# Altium schematic sheet SPI_IFC.SchDoc: Title
size 420 x 297 mm; Author: G.Kasprowicz; CompanyName: WUT ISE; DrawnBy: G.Kasprowicz; Organization: WUT ISE; Address1: PW ISE; Address2: Nowowiejska 15/19 00-665 Warsaw; Address3: gkasprow@gmail.com; Revision: 1.0; SheetNumber: 2; SheetTotal: 2; ModifiedBy: -; CheckedDate: -; Title2: Title2; DivGrp: WUT ISE; Designer: G.Kasprowicz; SPICEModelCacheRYPVXPCY: <root> / <DocumentId>RYPVXPCY</DocumentId> / </root>; ModifiedDate: -; ProjectName: Sensor Box
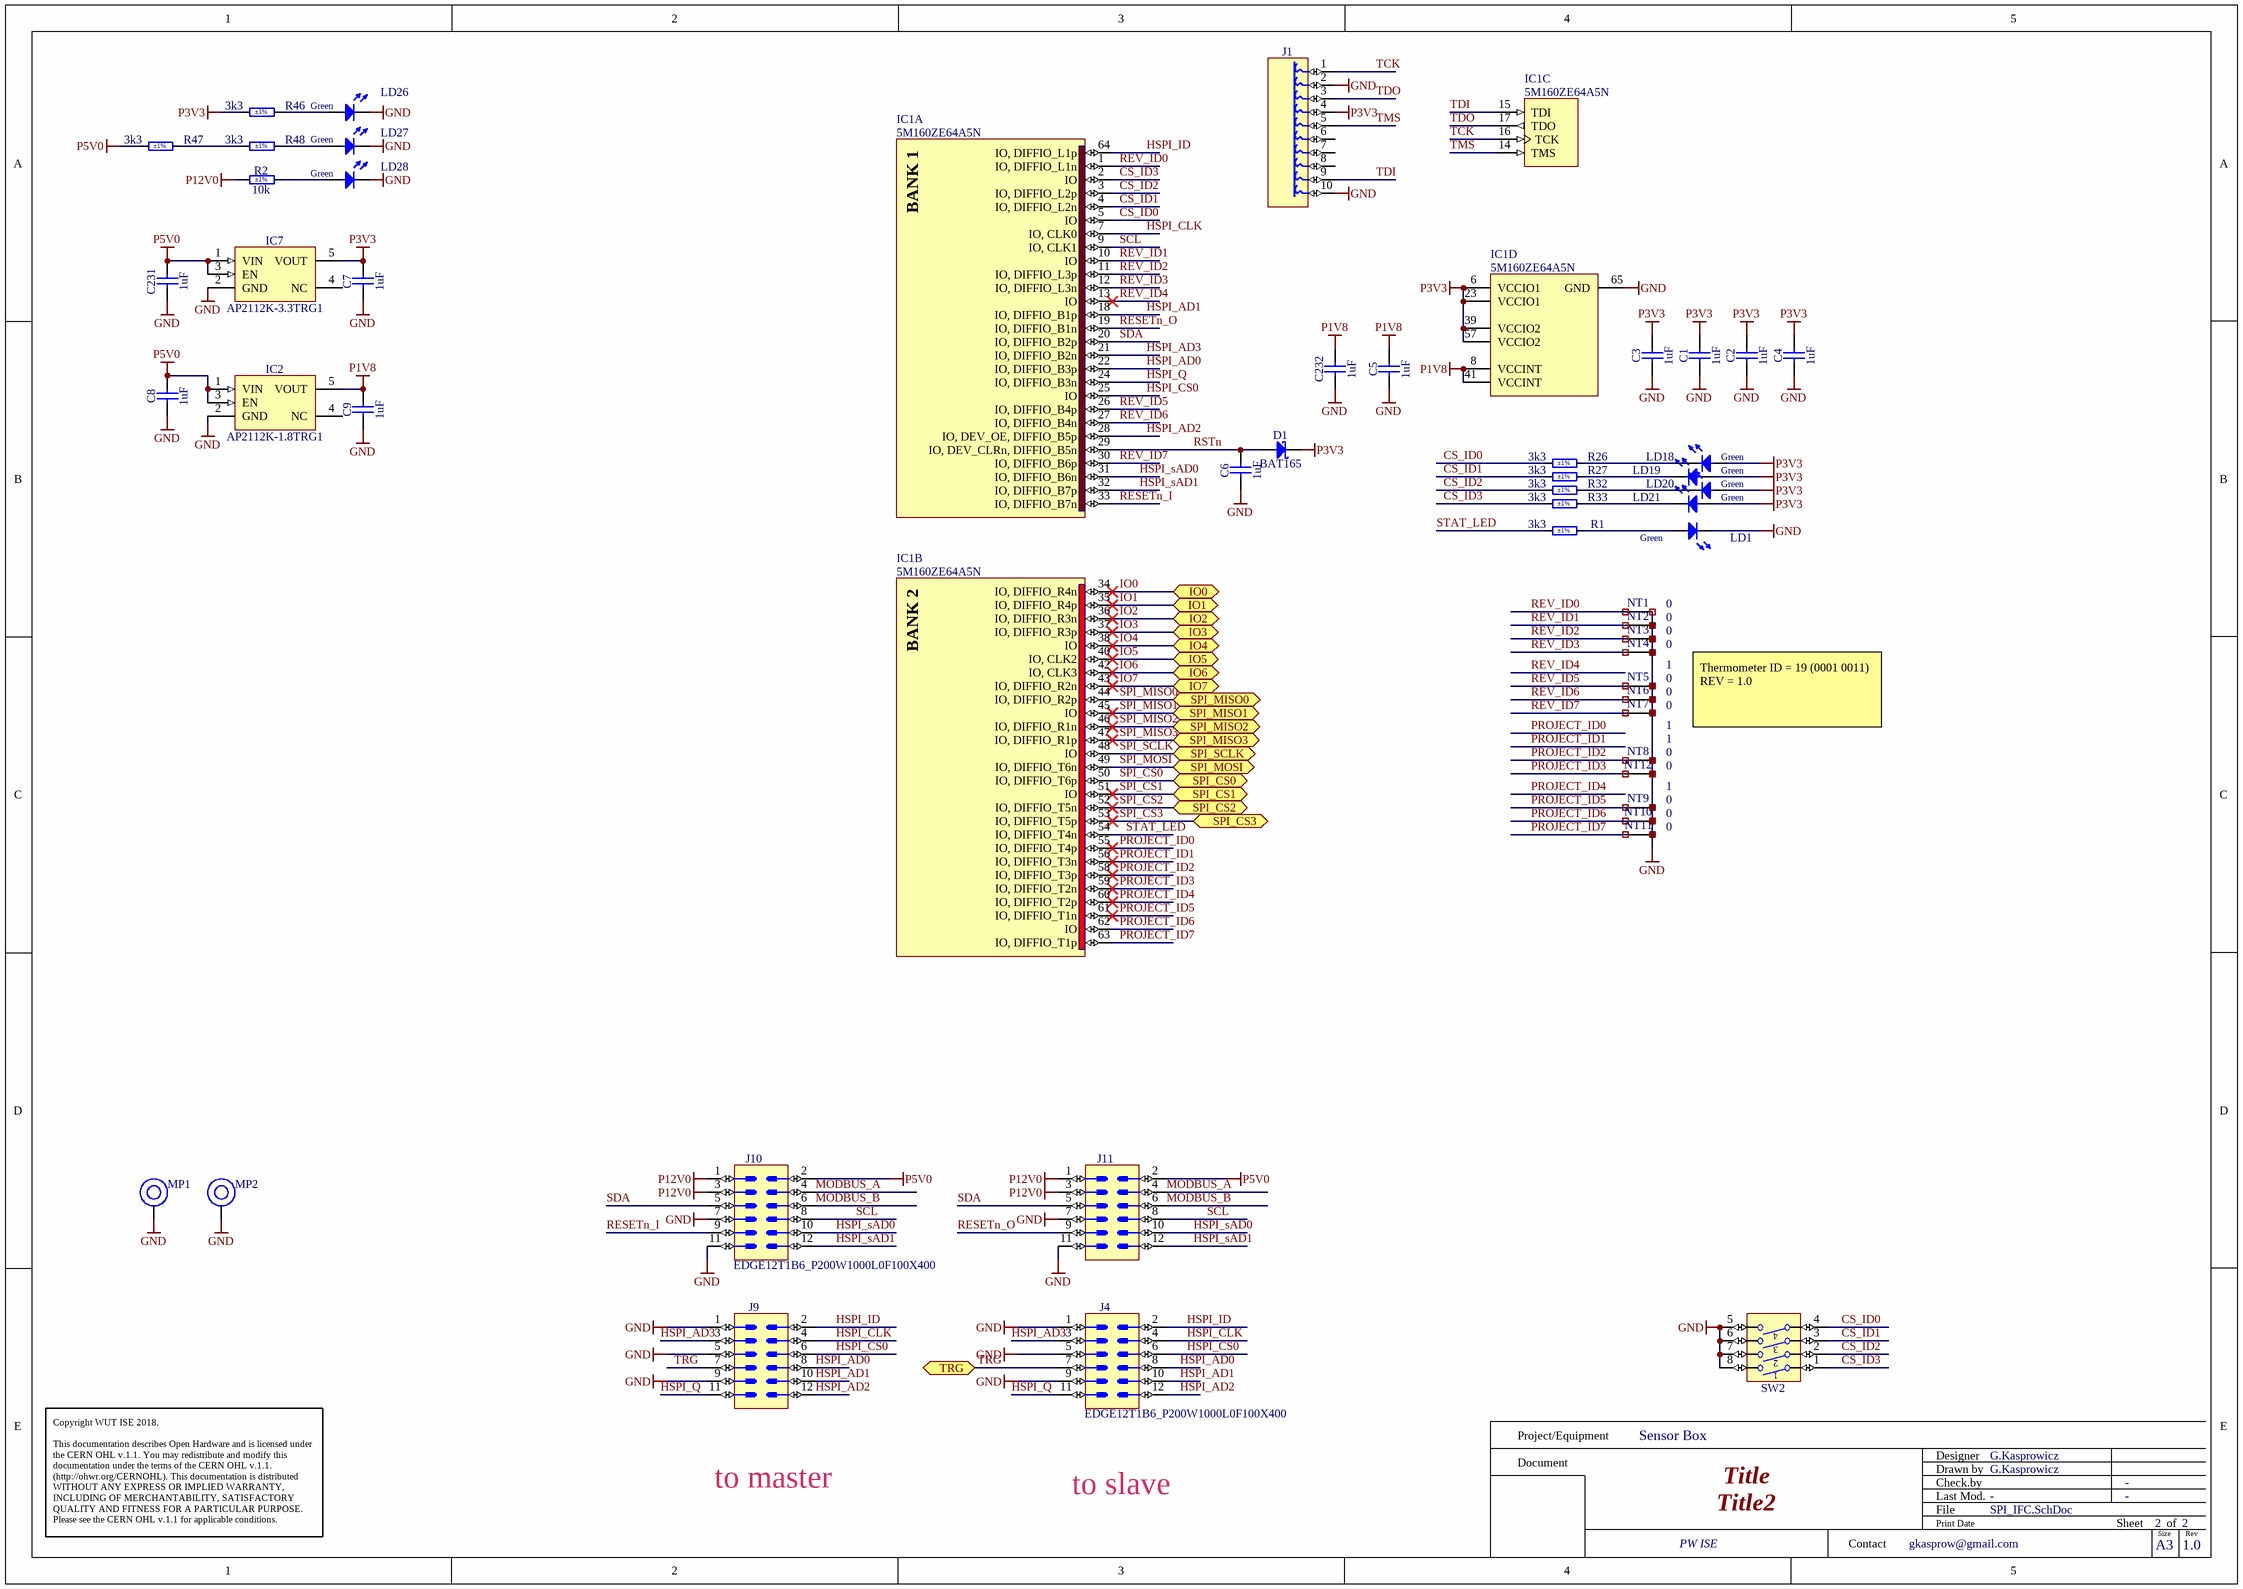
[diagram p0: SPI_IFC.SchDoc]

## Parts
C1  1uF  [CAPC1005X55N]
C2  1uF  [CAPC1005X55N]
C3  1uF  [CAPC1005X55N]
C4  1uF  [CAPC1005X55N]
C5  1uF  [CAPC1005X55N]
C6  1uF  [CAPC1005X55N]
C7  1uF  [CAPC1005X55N]
C8  1uF  [CAPC1005X55N]
C9  1uF  [CAPC1005X55N]
C231  1uF  [CAPC1005X55N]
C232  1uF  [CAPC1005X55N]
D1  BAT165  [SOD2512X110N]
IC1  5M160ZE64A5N  [QFP40P900X900X120-65N-S550]  (parts A,B,C,D of 4)
IC2  AP2112K-1.8TRG1  [SOT95P285X140-5N]
IC7  AP2112K-3.3TRG1  [SOT95P285X140-5N]
J1  TC2050-IDC  [TC2050-IDC]  (value not drawn)
J4  (no value)  [EDGE12T1B6_P200W1000L0F100X400]
J9  (no value)  [EDGE12T5B10_P200W1000L0F100X400]
J10  (no value)  [EDGE12T1B6_P200W1000L0F100X400]
J11  (no value)  [EDGE12T5B10_P200W1000L0F100X400]
LD1  Green  [LED_KINGBRIGHT_KP-1608CGCK]
LD18  Green  [LED_KINGBRIGHT_KP-1608CGCK]
LD19  Green  [LED_KINGBRIGHT_KP-1608CGCK]
LD20  Green  [LED_KINGBRIGHT_KP-1608CGCK]
LD21  Green  [LED_KINGBRIGHT_KP-1608CGCK]
LD26  Green  [LED_KINGBRIGHT_KP-1608CGCK]
LD27  Green  [LED_KINGBRIGHT_KP-1608CGCK]
LD28  Green  [LED_KINGBRIGHT_KP-1608CGCK]
MP1  M1.6 x 3mm  [97730306330]  (value not drawn)
MP2  M1.6 x 3mm  [97730306330]  (value not drawn)
NT1  Net Tie  [Net Tie 3]  (value not drawn)  (net tie, no BOM)
NT2  Net Tie  [Net Tie 3]  (value not drawn)  (net tie, no BOM)
NT3  Net Tie  [Net Tie 3]  (value not drawn)  (net tie, no BOM)
NT4  Net Tie  [Net Tie 3]  (value not drawn)  (net tie, no BOM)
NT5  Net Tie  [Net Tie 3]  (value not drawn)  (net tie, no BOM)
NT6  Net Tie  [Net Tie 3]  (value not drawn)  (net tie, no BOM)
NT7  Net Tie  [Net Tie 3]  (value not drawn)  (net tie, no BOM)
NT8  Net Tie  [Net Tie 3]  (value not drawn)  (net tie, no BOM)
NT9  Net Tie  [Net Tie 3]  (value not drawn)  (net tie, no BOM)
NT10  Net Tie  [Net Tie 3]  (value not drawn)  (net tie, no BOM)
NT11  Net Tie  [Net Tie 3]  (value not drawn)  (net tie, no BOM)
NT12  Net Tie  [Net Tie 3]  (value not drawn)  (net tie, no BOM)
R1  3k3  Tolerance: ±1%  [RESC1005X40N]
R2  10k  Tolerance: ±1%  [RESC1005X40N]
R26  3k3  Tolerance: ±1%  [RESC1005X40N]
R27  3k3  Tolerance: ±1%  [RESC1005X40N]
R32  3k3  Tolerance: ±1%  [RESC1005X40N]
R33  3k3  Tolerance: ±1%  [RESC1005X40N]
R46  3k3  Tolerance: ±1%  [RESC1005X40N]
R47  3k3  Tolerance: ±1%  [RESC1005X40N]
R48  3k3  Tolerance: ±1%  [RESC1005X40N]
SW2  Switch  [SW_OMRON_A6H-4102]  (value not drawn)

## Ports
IO0 (bidir), IO1 (bidir), IO2 (bidir), IO3 (bidir), IO4 (bidir), IO5 (bidir), IO6 (bidir), IO7 (bidir), SPI_CS0 (bidir), SPI_CS1 (bidir), SPI_CS2 (bidir), SPI_CS3 (bidir), SPI_MISO0 (bidir), SPI_MISO1 (bidir), SPI_MISO2 (bidir), SPI_MISO3 (bidir), SPI_MOSI (bidir), SPI_SCLK (bidir), TRG (bidir)

## Nets
GND: C1.1 C2.1 C3.1 C4.1 C5.1 C6.1 C7.1 C8.1 C9.1 C231.1 C232.1 IC1.65(GND) IC2.2(GND) IC7.2(GND) J1.2 J1.10 J4.1 J4.5 J4.9 J9.1 J9.5 J9.9 J10.7 J10.11 J11.7 J11.11 LD1.1(C) LD26.1(C) LD27.1(C) LD28.1(C) MP1.1 MP2.1 NT1.2 NT2.2 NT3.2 NT4.2 NT5.2 NT6.2 NT7.2 NT8.2 NT9.2 NT10.2 NT11.2 NT12.2 SW2.5 SW2.6 SW2.7 SW2.8
P1V8: C5.2 C9.2 C232.2 IC1.8(VCCINT) IC1.41(VCCINT) IC2.5(VOUT)
P3V3: C1.2 C2.2 C3.2 C4.2 C7.2 D1.1(C) IC1.6(VCCIO1) IC1.23(VCCIO1) IC1.39(VCCIO2) IC1.57(VCCIO2) IC7.5(VOUT) J1.4 LD18.2(A) LD19.2(A) LD20.2(A) LD21.2(A) R46.2
P5V0: C8.2 C231.2 IC2.1(VIN) IC2.3(EN) IC7.1(VIN) IC7.3(EN) J10.2 J11.2 R47.2
P12V0: J10.1 J10.3 J11.1 J11.3 R2.1
CS_ID0: IC1.5(IO) R26.2 SW2.4
CS_ID1: IC1.4(IO,_DIFFIO_L2n) R27.2 SW2.3
CS_ID2: IC1.3(IO,_DIFFIO_L2p) R32.2 SW2.2
CS_ID3: IC1.2(IO) R33.2 SW2.1
HSPI_AD0: IC1.22(IO,_DIFFIO_B3p) J4.8 J9.8
HSPI_AD1: IC1.18(IO,_DIFFIO_B1p) J4.10 J9.10
HSPI_AD2: IC1.28(IO,_DEV_OE,_DIFFIO_B5p) J4.12 J9.12
HSPI_AD3: IC1.21(IO,_DIFFIO_B2n) J4.3 J9.3
HSPI_CLK: IC1.7(IO,_CLK0) J4.4 J9.4
HSPI_CS0: IC1.25(IO) J4.6 J9.6
HSPI_ID: IC1.64(IO,_DIFFIO_L1p) J4.2 J9.2
HSPI_Q: IC1.24(IO,_DIFFIO_B3n) J4.11 J9.11
HSPI_sAD0: IC1.31(IO,_DIFFIO_B6n) J10.10 J11.10
HSPI_sAD1: IC1.32(IO,_DIFFIO_B7p) J10.12 J11.12
IO0: IC1.34(IO,_DIFFIO_R4n) ; port IO0
IO1: IC1.35(IO,_DIFFIO_R4p) ; port IO1
IO2: IC1.36(IO,_DIFFIO_R3n) ; port IO2
IO3: IC1.37(IO,_DIFFIO_R3p) ; port IO3
IO4: IC1.38(IO) ; port IO4
IO5: IC1.40(IO,_CLK2) ; port IO5
IO6: IC1.42(IO,_CLK3) ; port IO6
IO7: IC1.43(IO,_DIFFIO_R2n) ; port IO7
MODBUS_A: J10.4 J11.4
MODBUS_B: J10.6 J11.6
PROJECT_ID0: IC1.55(IO,_DIFFIO_T4p)
PROJECT_ID1: IC1.56(IO,_DIFFIO_T3n)
PROJECT_ID2: IC1.58(IO,_DIFFIO_T3p) NT8.1
PROJECT_ID3: IC1.59(IO,_DIFFIO_T2n) NT12.1
PROJECT_ID4: IC1.60(IO,_DIFFIO_T2p)
PROJECT_ID5: IC1.61(IO,_DIFFIO_T1n) NT9.1
PROJECT_ID6: IC1.62(IO) NT10.1
PROJECT_ID7: IC1.63(IO,_DIFFIO_T1p) NT11.1
RESETn_I: IC1.33(IO,_DIFFIO_B7n) J10.9
RESETn_O: IC1.19(IO,_DIFFIO_B1n) J11.9
REV_ID0: IC1.1(IO,_DIFFIO_L1n) NT1.1
REV_ID1: IC1.10(IO) NT2.1
REV_ID2: IC1.11(IO,_DIFFIO_L3p) NT3.1
REV_ID3: IC1.12(IO,_DIFFIO_L3n) NT4.1
REV_ID4: IC1.13(IO)
REV_ID5: IC1.26(IO,_DIFFIO_B4p) NT5.1
REV_ID6: IC1.27(IO,_DIFFIO_B4n) NT6.1
REV_ID7: IC1.30(IO,_DIFFIO_B6p) NT7.1
RSTn: C6.2 D1.2(A) IC1.29(IO,_DEV_CLRn,_DIFFIO_B5n)
SCL: IC1.9(IO,_CLK1) J10.8 J11.8
SDA: IC1.20(IO,_DIFFIO_B2p) J10.5 J11.5
SPI_CS0: IC1.50(IO,_DIFFIO_T6p) ; port SPI_CS0
SPI_CS1: IC1.51(IO) ; port SPI_CS1
SPI_CS2: IC1.52(IO,_DIFFIO_T5n) ; port SPI_CS2
SPI_CS3: IC1.53(IO,_DIFFIO_T5p) ; port SPI_CS3
SPI_MISO0: IC1.44(IO,_DIFFIO_R2p) ; port SPI_MISO0
SPI_MISO1: IC1.45(IO) ; port SPI_MISO1
SPI_MISO2: IC1.46(IO,_DIFFIO_R1n) ; port SPI_MISO2
SPI_MISO3: IC1.47(IO,_DIFFIO_R1p) ; port SPI_MISO3
SPI_MOSI: IC1.49(IO,_DIFFIO_T6n) ; port SPI_MOSI
SPI_SCLK: IC1.48(IO) ; port SPI_SCLK
STAT_LED: IC1.54(IO,_DIFFIO_T4n) R1.2
TCK: IC1.16(TCK) J1.1
TDI: IC1.15(TDI) J1.9
TDO: IC1.17(TDO) J1.3
TMS: IC1.14(TMS) J1.5
TRG: J4.7 J9.7 ; port TRG
NetLD1_2: LD1.2(A) R1.1
NetLD18_1: LD18.1(C) R26.1
NetLD19_1: LD19.1(C) R27.1
NetLD20_1: LD20.1(C) R32.1
NetLD21_1: LD21.1(C) R33.1
NetLD26_2: LD26.2(A) R46.1
NetLD27_2: LD27.2(A) R48.1
NetLD28_2: LD28.2(A) R2.2
NetR47_1: R47.1 R48.2

Not connected (* = marked no-connect by the designer): IC2 4(NC); IC7 4(NC); J1 6 7 8

## Notes on the sheet
- 0
- 1
- Thermometer ID = 19 (0001 0011)
  REV = 1.0
- to master
- to slave
- Project/Equipment
- Document
- Designer
- Drawn by
- Check.by
- Copyright WUT ISE 2018.
  This documentation describes Open Hardware and is licensed under the CERN OHL v.1.1. You may redistribute and modify this documentation under the terms of the CERN OHL v.1.1. (http://ohwr.org/CERNOHL). This documentation is distributed WITHOUT ANY EXPRESS OR IMPLIED WARRANTY, INCLUDING OF MERCHANTABILITY, SATISFACTORY QUALITY AND FITNESS FOR A PARTICULAR PURPOSE. Please see the CERN OHL v.1.1 for applicable conditions.
- Contact
- File
- Last Mod.
- Print Date
- Sheet
- Size
- A3
- of
- Rev
- (in symbol 5M160ZE64A5N, part A) BANK 1
- (in symbol 5M160ZE64A5N, part B) BANK 2

## Library data of the parts
C1-C9 C231 C232 = CC0402_1UF_16V_10%_X5R: Non-polarised capacitor; Part Description: SMD Multilayer Chip Ceramic Capacitor; Manufacturer: GENERIC; Manufacturer1 Part Number: C1005X5R1C105KT; Voltage: 16V; TC: X5R; Tolerance: ±10%; Part Number: CC0402_1UF_16V_10%_X5R; Component Kind: Standard; Component Type: Standard; Pin Count: 2; Value: 1uF; Status: Preferred; Manufacturer Part Number: CC0402_1UF_16V_10%_X5R; Case: 0402; Mounted: Yes; Socket: No; SMD: Yes; Sense: No; Manufacturer1 Example: TDK; Manufacturer1 ComponentHeight: 0.55mm; HelpURL: \\cern.ch\dfs\Applications\Altium\Datasheets\CC0402_X5R_TDK_C.pdf; Author: CERN DEM JLC; CreateDate: 25.10.2012; LatestRevisionDate: 25.10.2012
D1 = BAT165: Schottky Diode; Part Description: Medium Power AF Schottky Diode; Manufacturer: INFINEON; Voltage: 40V; Power: 750mA; PressFit: No; Bonding: No; Part Number: BAT165; Component Kind: Standard; Component Type: Standard; Device: BAT165; PackageDescription: Small Outline Diode (SOD-323), 1.70mm W X 1.25mm L X 1.10mm H body,  IPC Medium Density; Manufacturer Part Number: BAT165; Pin Count: 2; Case: SOD-323; Mounted: Yes; Socket: No; SMD: Yes; Sense: No; ComponentHeight: 1.1mm; HelpURL: \\cern.ch\dfs\Applications\Altium\Datasheets\BAT165.pdf; Author: CERN DEM JLC; CreateDate: 12.11.2014; LatestRevisionDate: 12.11.2014
IC1 = 5M160ZE64A5N: MAX V 1.8V CPLD, 54 IOs, 160 Logic Elements, 64-Pin EQFP, Automotive Temperature, Speed Grade 5, Pb-Free; Manufacturer: ALTERA; PressFit: No; Bonding: No; Part Number: 5M160ZE64A5N; Component Kind: Standard; Component Type: Standard; Device: 5M160ZE64A5N; PackageDescription: QFP, 0.40mm Pitch, Square; 64 pin, 7.00mm L X 7.00mm W X 1.20mm H body (w/Thermal Tab 5.50 X 5.50mm), IPC Medium Density; Status: Not Recommended; Part Description: MAX V 1.8V CPLD, 54 IOs, 160 Logic Elements, 64-Pin EQFP, Automotive Temperature, Speed Grade 5, Pb-Free; Manufacturer Part Number: 5M160ZE64A5N; Pin Count: 65; Case: QFP64; Mounted: Yes; Socket: No; SMD: Yes; Sense: No; ComponentHeight: 1.2mm; HelpURL: \\cern.ch\dfs\Applications\Altium\Datasheets\5M160ZE64A5N.pdf; ComponentLink1URL: \\cern.ch\dfs\Applications\Altium\Datasheets\5M160ZE64A5N_Package.pdf; ComponentLink1Description: Package Drawing; ComponentLink2URL: \\cern.ch\dfs\Applications\Altium\Datasheets\5M160ZE64A5N_Pinout.pdf; ComponentLink2Description: Pinout; Author: CERN DEM JLC; CreateDate: 07.01.2015; LatestRevisionDate: 27.10.2022
IC2 = AP2112K-1.8TRG1: 600mA CMOS Low Dropout Linear Regulator with Enable; Part Description: 1.8V 600mA CMOS Low Dropout Linear Regulator with Enable; Manufacturer: DIODES INCORPORATED; PressFit: No; Bonding: No; Part Number: AP2112K-1.8TRG1; Component Kind: Standard; Component Type: Standard; Device: AP2112K-1.8TRG1; PackageDescription: SOT23, 0.95mm Pitch; 5 Pin, 1.6mm W X 3.0mm L X 1.40mm H body, IPC Medium Density; Manufacturer Part Number: AP2112K-1.8; Pin Count: 5; Case: SOT25; Mounted: Yes; Socket: No; SMD: Yes; Sense: No; ComponentHeight: 1.4mm; HelpURL: \\cern.ch\dfs\Applications\Altium\Datasheets\AP2112K-1.8TRG1.pdf; Author: CERN DEM JLC; CreateDate: 13.06.2018; LatestRevisionDate: 27.06.2022
IC7 = AP2112K-3.3TRG1: 600mA CMOS Low Dropout Linear Regulator with Enable; Part Description: 3.3V 600mA CMOS Low Dropout Linear Regulator with Enable; Manufacturer: DIODES INCORPORATED; PressFit: No; Bonding: No; Part Number: AP2112K-3.3TRG1; Component Kind: Standard; Component Type: Standard; Device: AP2112K-3.3TRG1; PackageDescription: SOT23, 0.95mm Pitch; 5 Pin, 1.6mm W X 3.0mm L X 1.40mm H body, IPC Medium Density; Manufacturer Part Number: AP2112K-3.3; Pin Count: 5; Case: SOT25; Mounted: Yes; Socket: No; SMD: Yes; Sense: No; ComponentHeight: 1.4mm; HelpURL: \\cern.ch\dfs\Applications\Altium\Datasheets\AP2112K-3.3TRG1.pdf; Author: CERN DEM MR; CreateDate: 13.12.2017; LatestRevisionDate: 27.06.2022
J1 = TC2050-IDC: TC2030-MCP and TC2050-IDC Pad Contact; Part Description: 10 X 31mil Diameter SMD Pad For TC2050-IDC Legged Connector; Mounted: No; Part Number: TC2050-IDC; Component Kind: Standard (No BOM); Component Type: Standard (No BOM); Pin Count: 10; Family: TC2050-IDC; Socket: No; SMD: Yes; Sense: No; Status: None; ComponentHeight: 0mm; HelpURL: \\cern.ch\dfs\Applications\Altium\Datasheets\TC2050-IDC.pdf; Author: CERN DEM HF; CreateDate: 02.05.2024; LatestRevisionDate: 02.05.2024; PackageDescription: 10 X 31mil Diameter SMD Pad For TC2030-MCP Legged Connector
J4 J10 = PCB Edge Connector 12 (2x6): Part Number: EDGE10T1B6_P200W1000L0F100X400; Part Description: 10 Contacts Board Edge Connector, Pitch 2mm, Length 0mm, Width 10mm, Finger Lenght 4mm, Finger Width 1mm; Mounted: No; PressFit: No; Component Kind: Standard (No BOM); Component Type: Standard (No BOM); Pin Count: 12; Socket: No; SMD: No; Sense: No; Status: None; ComponentHeight: 0mm; HelpURL: \\cern.ch\dfs\Applications\Altium\Datasheets\EDGE10T1B6_P200W1000L0F100X400.pdf; Author: CERN DEM MR; CreateDate: 14.02.2018; LatestRevisionDate: 14.02.2018
J9 J11 = PCB Edge Connector 12 (2x6) R: PCB Edge Connector 12 (2x6); Part Description: 12 Contacts Board Edge Connector, Pitch 2mm, Length 0mm, Width 10mm, Finger Lenght 4mm, Finger Width 1mm; Mounted: No; PressFit: No; Part Number: EDGE12T5B10_P200W1000L0F100X400; Component Kind: Standard (No BOM); Component Type: Standard (No BOM); Pin Count: 12; Socket: No; SMD: No; Sense: No; Status: None; ComponentHeight: 0mm; HelpURL: \\cern.ch\dfs\Applications\Altium\Datasheets\EDGE10T5B10_P200W1000L0F100X400.pdf; Author: GK; CreateDate: 14.02.2018; LatestRevisionDate: 14.02.2018
LD1 LD18-LD21 LD26-LD28 = LED_KINGBRIGHT_KP-1608CGCK: LED Green 1C 2A; Part Description: 1.6x0.8mm SMD Chip Green LED Lamp; PressFit: No; Bonding: No; Part Number: LED_KINGBRIGHT_KP-1608CGCK; Component Kind: Standard; Component Type: Standard; Color: Green; PackageDescription: SMT Green LED, Case 0603, Body L 1.60mm x W 0.80mm x H 1.10mm; Manufacturer: KINGBRIGHT; Manufacturer Part Number: KP-1608CGCK; Pin Count: 2; Case: 0603; Mounted: Yes; Socket: No; SMD: Yes; Sense: No; ComponentHeight: 1.1mm; HelpURL: \\cern.ch\dfs\Applications\Altium\Datasheets\LED_KINGBRIGHT_KP-1608CGCK.pdf; Author: CERN DEM HF; CreateDate: 01.10.2021; LatestRevisionDate: 01.10.2021
MP1 MP2 = 97730306330R: WA-SMSI SMT Steel Spacer with internal Thread Bottom closed, OD 3.3mm, M1.6 x 3mm; Manufacturer: Wurth Elektronik; Inside Thread Length: 1.8mm; Surface: Tin; ComponentLink1Description: Website Link; ComponentLink1URL: https://www.we-online.com/redexpert/article/97730306330R?ad; ComponentLink2Description: Datasheet Link; ComponentLink2URL: https://www.we-online.com/redexpert/spec/97730306330R?ad; Manufacturer Part Number: 97730306330R; Category: SMT Spacers; Match Code: WA-SMSI; Mount: Surface Mount; Operating Temperature Max: 150°C; Operating Temperature Min: -55°C; Packaging: Tape and Reel; Height: 3mm; Material: Steel; Outside Diameter: 3.3mm; Thread Size: M1.6
NT1-NT12 = Net Tie 3: Part Description: Net Tie (2 Nets); Mounted: No; Part Number: Net Tie 3; Component Type: Net Tie; Pin Count: 2; Family: Net Tie; Socket: No; SMD: No; Sense: No; Status: None; ComponentHeight: 0mm; HelpURL: Undefined; Author: CERN DEM HF; CreateDate: 23.09.2024; LatestRevisionDate: 23.09.2024; PackageDescription: SMD Net Tie
R1 R26 R27 R32 R33 R46-R48 = R0402_3K3_1%_0.0625W_100PPM: Resistor - 1%; Part Description: General Purpose Thick Film Chip Resistor; Manufacturer: GENERIC; Manufacturer1 Part Number: 232270673302L; TC: ±100ppm/°C; PressFit: No; Part Number: R0402_3K3_1%_0.0625W_100PPM; Component Kind: Standard; Component Type: Standard; Pin Count: 2; Value: 3k3; Status: Not Recommended; Power: 0.0625W; Manufacturer Part Number: R0402_3K3_1%_0.0625W_100PPM; Case: 0402; Mounted: Yes; Sense: No; Socket: No; SMD: Yes; Manufacturer1 Example: YAGEO PHYCOMP; Manufacturer1 ComponentHeight: 0.4mm; HelpURL: \\cern.ch\dfs\Applications\Altium\Datasheets\R0402_Phycomp_RC0402.pdf; Author: CERN DEM JLC; CreateDate: 03.12.2007; LatestRevisionDate: 17.10.2012
R2 = R0402_10K_1%_0.0625W_100PPM: Resistor - 1%; Part Description: General Purpose Thick Film Chip Resistor; Manufacturer: GENERIC; Manufacturer1 Part Number: 232270671003L; TC: ±100ppm/°C; PressFit: No; Part Number: R0402_10K_1%_0.0625W_100PPM; Component Kind: Standard; Component Type: Standard; Pin Count: 2; Value: 10k; Status: Not Recommended; Power: 0.0625W; Manufacturer Part Number: R0402_10K_1%_0.0625W_100PPM; Case: 0402; Mounted: Yes; Sense: No; Socket: No; SMD: Yes; Manufacturer1 Example: YAGEO PHYCOMP; Manufacturer1 ComponentHeight: 0.4mm; HelpURL: \\cern.ch\dfs\Applications\Altium\Datasheets\R0402_Phycomp_RC0402.pdf; Author: CERN DEM JLC; CreateDate: 03.12.2007; LatestRevisionDate: 17.10.2012
SW2 = SW_OMRON_A6H-4102: 4 Ways SPST DIP Switch; Part Description: 4 Ways Ultra-low Profile, Half-pitch, SPST DIP Switch with Seal Tape, Rating 25mA 24VDC; Manufacturer: OMRON; PressFit: No; Part Number: SW_OMRON_A6H-4102; Component Kind: Standard; Component Type: Standard; Pin Count: 8; PackageDescription: Pitch 1.27mm, Body 6.31 x 4.5mm, 4 Ways SPST Surface-Mounting DIP Switch, OMRON A6H; Family: Switch; Mounted: Yes; Socket: No; SMD: Yes; Sense: No; Status: None; Manufacturer Part Number: A6H-4102; ComponentHeight: 1.45mm; HelpURL: \\cern.ch\dfs\Applications\Altium\Datasheets\SW_OMRON_A6H-4102.pdf; Author: CERN DEM JLC; CreateDate: 17.12.2013; LatestRevisionDate: 17.12.2013